# EAGLE design headstage-with-omnetics (EAGLE 6.5.0)
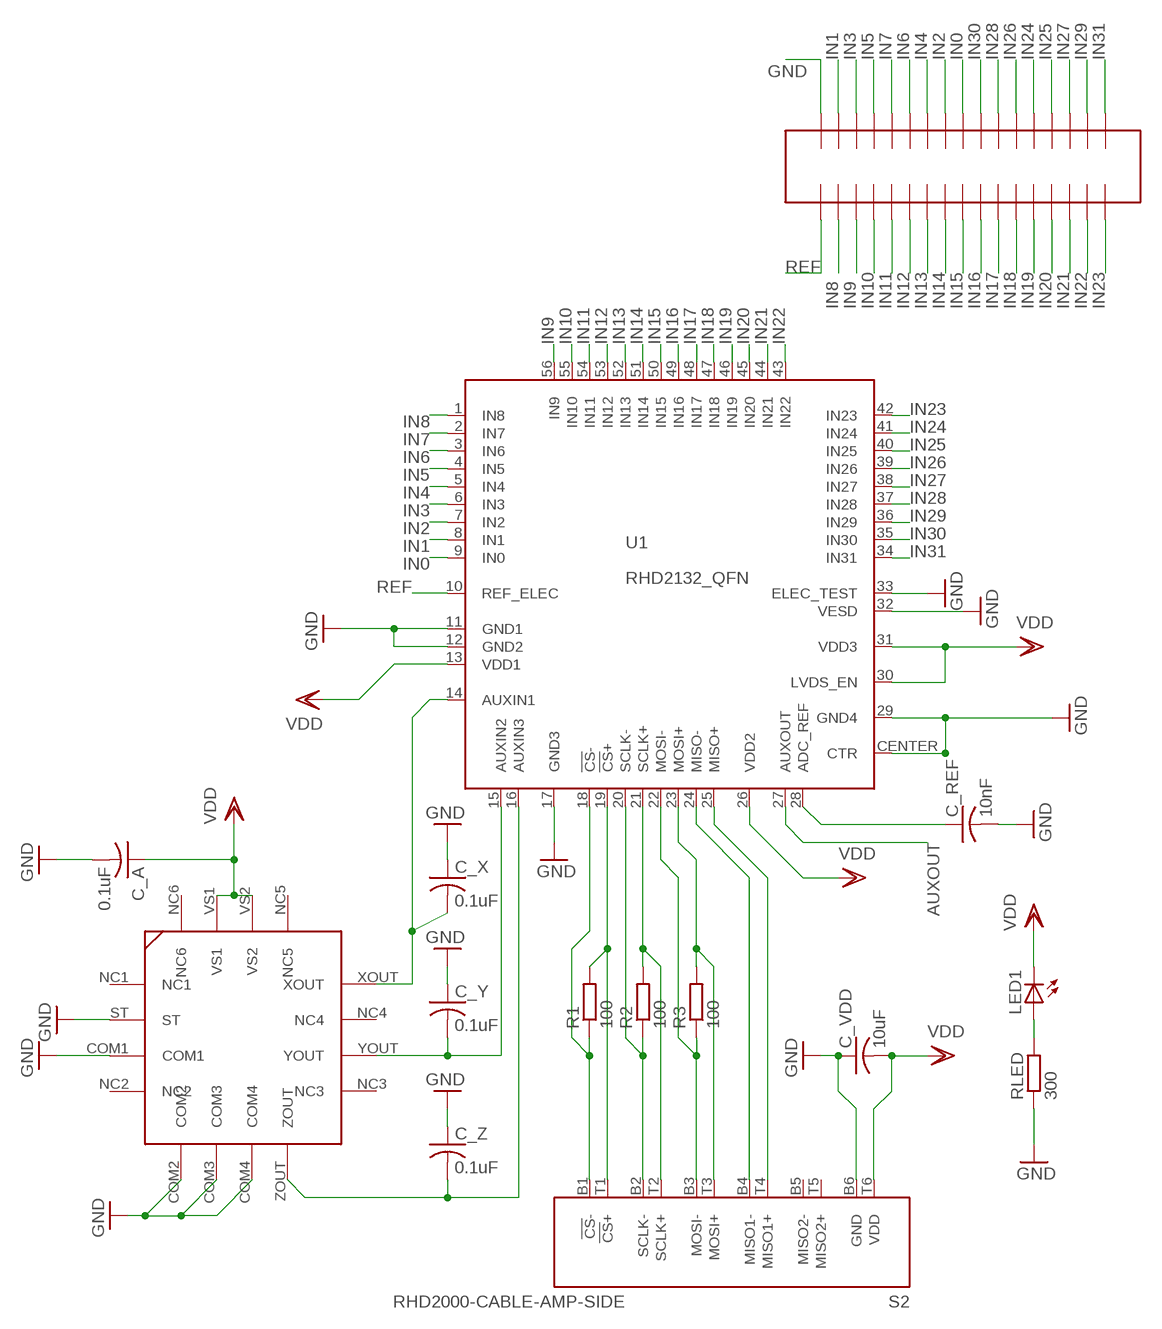
[diagram p0: schematic, sheet 1]

## Parts
C_A  0.1uF  C-USC0402K  [C0402K]
C_REF  10nF  C-USC0402K  [C0402K]
C_VDD  10uF  C-USC0805  [C0805]
C_X  0.1uF  C-USC0402K  [C0402K]
C_Y  0.1uF  C-USC0402K  [C0402K]
C_Z  0.1uF  C-USC0402K  [C0402K]
LED1  LEDCHIPLED_0805  [CHIPLED_0805]
R1  100  R-EU_R0402  [R0402]
R2  100  R-EU_R0402  [R0402]
R3  100  R-EU_R0402  [R0402]
RLED  300  R-EU_R0402  [R0402]
S2  RHD2000-CABLE-AMP-SIDE  [OMNETICS_PZN-12-AA]
U1  RHD2132_QFN  [QFN56_8_X_8_LARGE]
U$1  ADXL335  [ADXL335]
U$2  FTSH-117BOARD-END  [FTSH-117-END]

## Nets
ADC_REF: C_REF.1 U1.28(ADC_REF)
AUXOUT: U1.27(AUXOUT)
CS+: R1.2 S2.T1(!CS!+) U1.19(!CS!+)
CS-: R1.1 S2.B1(!CS!-) U1.18(!CS!-)
GND: C_A.2 C_REF.2 C_VDD.1 C_X.1 C_Y.1 C_Z.1 RLED.1 S2.B6(GND) U1.11(GND1) U1.12(GND2) U1.17(GND3) U1.29(GND4) U1.32(VESD) U1.33(ELEC_TEST) U1.CENTER(CTR) U$1.COM1 U$1.COM2 U$1.COM3 U$1.COM4 U$1.ST U$2.P$34
IN0: U1.9(IN0) U$2.P$26
IN1: U1.8(IN1) U$2.P$33
IN2: U1.7(IN2) U$2.P$27
IN3: U1.6(IN3) U$2.P$32
IN4: U1.5(IN4) U$2.P$28
IN5: U1.4(IN5) U$2.P$31
IN6: U1.3(IN6) U$2.P$29
IN7: U1.2(IN7) U$2.P$30
IN8: U1.1(IN8) U$2.P$2
IN9: U1.56(IN9) U$2.P$3
IN10: U1.55(IN10) U$2.P$4
IN11: U1.54(IN11) U$2.P$5
IN12: U1.53(IN12) U$2.P$6
IN13: U1.52(IN13) U$2.P$7
IN14: U1.51(IN14) U$2.P$8
IN15: U1.50(IN15) U$2.P$9
IN16: U1.49(IN16) U$2.P$10
IN17: U1.48(IN17) U$2.P$11
IN18: U1.47(IN18) U$2.P$12
IN19: U1.46(IN19) U$2.P$13
IN20: U1.45(IN20) U$2.P$14
IN21: U1.44(IN21) U$2.P$15
IN22: U1.43(IN22) U$2.P$16
IN23: U1.42(IN23) U$2.P$17
IN24: U1.41(IN24) U$2.P$22
IN25: U1.40(IN25) U$2.P$21
IN26: U1.39(IN26) U$2.P$23
IN27: U1.38(IN27) U$2.P$20
IN28: U1.37(IN28) U$2.P$24
IN29: U1.36(IN29) U$2.P$19
IN30: U1.35(IN30) U$2.P$25
IN31: U1.34(IN31) U$2.P$18
LEDOUT: LED1.A RLED.2
MISO1+: S2.T4(MISO1+) U1.25(MISO+)
MISO1-: S2.B4(MISO1-) U1.24(MISO-)
MOSI+: R3.2 S2.T3(MOSI+) U1.23(MOSI+)
MOSI-: R3.1 S2.B3(MOSI-) U1.22(MOSI-)
REF: U1.10(REF_ELEC) U$2.P$1
SCLK+: R2.2 S2.T2(SCLK+) U1.21(SCLK+)
SCLK-: R2.1 S2.B2(SCLK-) U1.20(SCLK-)
VDD: C_A.1 C_VDD.2 LED1.C S2.T6(VDD) U1.13(VDD1) U1.26(VDD2) U1.30(LVDS_EN) U1.31(VDD3) U$1.VS1 U$1.VS2
XOUT: C_X.2 U1.14(AUXIN1) U$1.XOUT
YOUT: C_Y.2 U1.15(AUXIN2) U$1.YOUT
ZOUT: C_Z.2 U1.16(AUXIN3) U$1.ZOUT
Unconnected: S2.B5(MISO2-) S2.T5(MISO2+) U$1.NC1 U$1.NC2 U$1.NC3 U$1.NC4 U$1.NC5 U$1.NC6

## Library data of the parts
C_A C_REF C_X C_Y C_Z = resistor:C-US: CAPACITOR, American symbol
C_VDD = rcl:C-US: CAPACITOR, American symbol
LED1 = led:LED: LED OSRAM: - CHIPLED LG R971, LG N971, LY N971, LG Q971, LY Q971, LO R971, LY R971 LH N974, LH R974 LS Q976, LO Q976, LY Q976 LO Q996 - Hyper CHIPLED LW Q18S LB Q993, LB Q99A, LB R99A - SideLED LS A670, LO A670, LY A670, LG A670, LP A670 LB A673, LV A673, LT A673, LW A673 LH A674 LY A675 LS A676, LA A676, LO A676, LY A676, LW A676 LS A679, LY A679, LG A679 - Hyper Micro SIDELED® LS Y876, LA Y876, LO Y876, LY Y876 LT Y87S - SmartLED LW L88C, LW L88S LB L89C, LB L89S, LG L890 LS L89K, LO L89K, LY L89K LS L896, LA L896, LO L896, LY L896 - TOPLED LS T670, LO T670, LY T670, LG T670, LP T670 LSG T670, LSP T670, LSY T670, LOP T670, LYG T670 LG T671, LOG T671, LSG T671 LB T673, LV T673, LT T673, LW T673 LH T674 LS T676, LA T676, LO T676, LY T676, LB T676, LH T676, LSB T676, LW T676 LB T67C, LV T67C, LT T67C, LS T67K, LO T67K, LY T67K, LW E67C LS E67B, LA E67B, LO E67B, LY E67B, LB E67C, LV E67C, LT E67C LW T67C LS T679, LY T679, LG T679 LS T770, LO T770, LY T770, LG T770, LP T770 LB T773, LV T773, LT T773, LW T773 LH T774 LS E675, LA E675, LY E675, LS T675 LS T776, LA T776, LO T776, LY T776, LB T776 LHGB T686 LT T68C, LB T68C - Hyper Mini TOPLED® LB M676 - Mini TOPLED Santana® LG M470 LS M47K, LO M47K, LY M47K Source: http://www.osram.convergy.de LUXEON: - LUMILED® LXK2-PW12-R00, LXK2-PW12-S00, LXK2-PW14-U00, LXK2-PW14-V00 LXK2-PM12-R00, LXK2-PM12-S00, LXK2-PM14-U00 LXK2-PE12-Q00, LXK2-PE12-R00, LXK2-PE12-S00, LXK2-PE14-T00, LXK2-PE14-U00 LXK2-PB12-K00, LXK2-PB12-L00, LXK2-PB12-M00, LXK2-PB14-N00, LXK2-PB14-P00, LXK2-PB14-Q00 LXK2-PR12-L00, LXK2-PR12-M00, LXK2-PR14-Q00, LXK2-PR14-R00 LXK2-PD12-Q00, LXK2-PD12-R00, LXK2-PD12-S00 LXK2-PH12-R00, LXK2-PH12-S00 LXK2-PL12-P00, LXK2-PL12-Q00, LXK2-PL12-R00 Source: www.luxeon.com KINGBRIGHT: KA-3528ASYC Source: www.kingbright.com
R1-R3 RLED = resistor:R-EU_: RESISTOR, European symbol
S2 = RHD2000:RHD2000-CABLE-AMP-SIDE
U1 = RHD2000:RHD2132
U$1 = voigts:ADXL335: The ADXL335 is a small, thin, low power, complete 3-axis accelerometer with signal conditioned voltage outputs. The product measures acceleration with a minimum full-scale range of ±3 g. It can measure the static acceleration of gravity in tilt-sensing applications, as well as dynamic acceleration resulting from motion, shock, or vibration. The user selects the bandwidth of the accelerometer using the CX, CY, and CZ capacitors at the XOUT, YOUT, and ZOUT pins. Bandwidths can be selected to suit the application, with a range of 0.5 Hz to 1600 Hz for the X and Y axes, and a range of 0.5 Hz to 550 Hz for the Z axi
U$2 = Samtec50Mil:FTSH-117: FTSH-117 17x2 Samtec Header 2 row 50 mil spacing

## Board
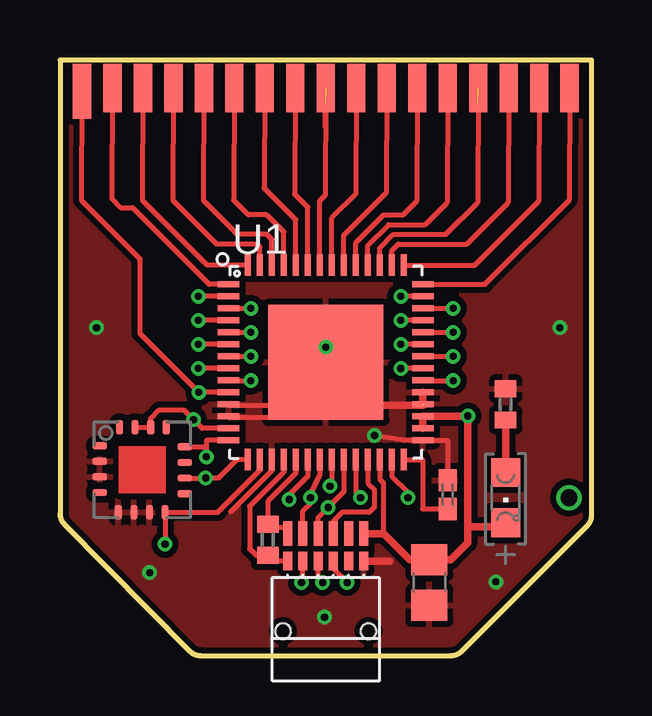
[diagram p1: board, top side]
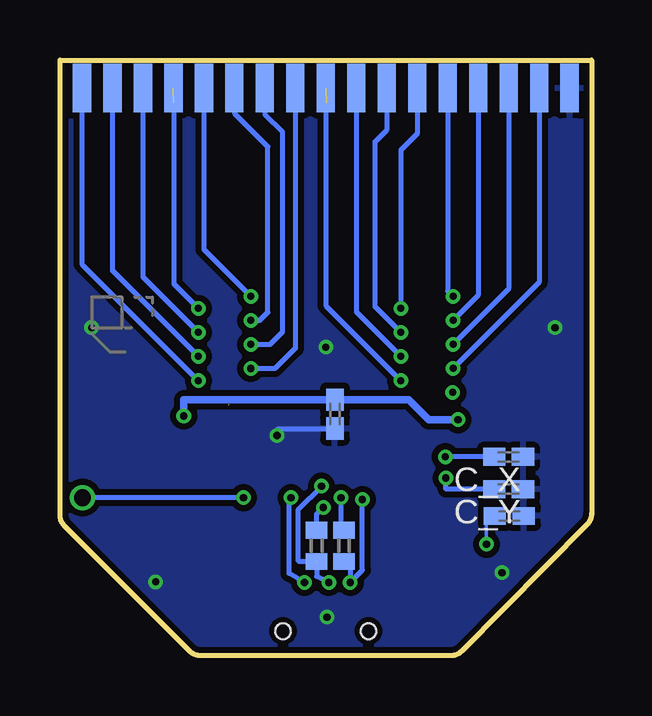
[diagram p2: board, bottom side, seen from below]

Size 22.15 x 24.82 mm. Coordinates in mm from the lower left corner, seen from the top.
Outline: 0,24.82 0,5.91 arc45 0.18,5.46 5.4,0.19 arc45 5.85,0 16.3,0 arc45 16.75,0.19 21.96,5.4 arc45 22.15,5.85 22.15,24.82 0,24.82
Copper layers (1*16): Top 0.035mm / dielectric 1.5mm / Bottom 0.035mm
Design rules "Fusion_eagle_rule_v1.1 *": minimum track width 6mil, minimum drill 0.3mm, track to track 6mil, track to pad 6mil, pad to pad 6mil, via to via 6mil, smd to smd 0mil, copper to edge 10mil, drill to drill 10mil, minimum pad ring 10mil, minimum via ring 6mil, stop-mask expansion 2mil, vias tented up to drill 100mil, thermal gap 10mil
Holes 0.64 mm at 9.3,1.02 12.85,1.02

### Footprints (pad centres in the part's own frame; a part is rotated, then mirrored left to right if it is on the bottom)
C0402K = smd 0.925 x 0.74: 1 -0.6,0; 2 0.6,0
C0805 = smd 1.3 x 1.5: 1 -0.95,0; 2 0.95,0
CHIPLED_0805 = smd 1.2 x 1.2: A 0,-1.05; C 0,1.05
R0402 = smd 0.7 x 0.9: 1 -0.65,0; 2 0.65,0
OMNETICS_PZN-12-AA = smd 0.381 x 0.762: B1 1.587,-1.016; B2 0.953,-1.016; B3 0.318,-1.016; B4 -0.318,-1.016; B5 -0.953,-1.016; B6 -1.587,-1.016 | smd 0.381 x 1.016: T1 1.587,-2.159; T2 0.953,-2.159; T3 0.318,-2.159; T4 -0.318,-2.159; T5 -0.953,-2.159; T6 -1.587,-2.159
QFN56_8_X_8_LARGE = smd 0.9 x 0.25: 1 -4.05,3.25; 2 -4.05,2.75; 3 -4.05,2.25; 4 -4.05,1.75; 5 -4.05,1.25; 6 -4.05,0.75; 7 -4.05,0.25; 8 -4.05,-0.25; 9 -4.05,-0.75; 10 -4.05,-1.25; 11 -4.05,-1.75; 12 -4.05,-2.25; 13 -4.05,-2.75; 14 -4.05,-3.25; 29 4.05,-3.25; 30 4.05,-2.75; 31 4.05,-2.25; 32 4.05,-1.75; 33 4.05,-1.25; 34 4.05,-0.75; 35 4.05,-0.25; 36 4.05,0.25; 37 4.05,0.75; 38 4.05,1.25; 39 4.05,1.75; 40 4.05,2.25; 41 4.05,2.75; 42 4.05,3.25 | smd 0.25 x 0.9: 15 -3.25,-4.05; 16 -2.75,-4.05; 17 -2.25,-4.05; 18 -1.75,-4.05; 19 -1.25,-4.05; 20 -0.75,-4.05; 21 -0.25,-4.05; 22 0.25,-4.05; 23 0.75,-4.05; 24 1.25,-4.05; 25 1.75,-4.05; 26 2.25,-4.05; 27 2.75,-4.05; 28 3.25,-4.05; 43 3.25,4.05; 44 2.75,4.05; 45 2.25,4.05; 46 1.75,4.05; 47 1.25,4.05; 48 0.75,4.05; 49 0.25,4.05; 50 -0.25,4.05; 51 -0.75,4.05; 52 -1.25,4.05; 53 -1.75,4.05; 54 -2.25,4.05; 55 -2.75,4.05; 56 -3.25,4.05 | smd 4.8 x 4.8: CENTER 0,0
ADXL335 = smd 0.61 x 0.305: COM1 -1.775,-0.3; NC1 -1.775,1; NC2 -1.775,-0.95; NC3 1.775,-1; NC4 1.775,0.3; ST -1.775,0.35; XOUT 1.775,0.95; YOUT 1.775,-0.35 | smd 0.305 x 0.61: COM2 -1,-1.775; COM3 -0.35,-1.775; COM4 0.3,-1.775; NC5 1,1.775; NC6 -0.95,1.775; VS1 0.35,1.775; VS2 -0.3,1.775; ZOUT 0.95,-1.775
FTSH-117-END = smd 0.762 x 2.286: P$1 -10.16,-0.127 | smd 0.762 x 2.032: P$2 -8.89,0; P$3 -7.62,0; P$4 -6.35,0; P$5 -5.08,0; P$6 -3.81,0; P$7 -2.54,0; P$8 -1.27,0; P$9 0,0; P$10 1.27,0; P$11 2.54,0; P$12 3.81,0; P$13 5.08,0; P$14 6.35,0; P$15 7.62,0; P$16 8.89,0; P$17 10.16,0 | smd 0.762 x 2.032 bottom: P$18 10.16,0; P$19 8.89,0; P$20 7.62,0; P$21 6.35,0; P$22 5.08,0; P$23 3.81,0; P$24 2.54,0; P$25 1.27,0; P$26 0,0; P$27 -1.27,0; P$28 -2.54,0; P$29 -3.81,0; P$30 -5.08,0; P$31 -6.35,0; P$32 -7.62,0; P$33 -8.89,0; P$34 -10.16,0

### Placement (x,y rotation side)
C_A  10.69,10.06 270 bottom
C_REF  16.15,6.71 90 top
C_VDD  15.39,3.05 90 top
C_X  3.45,8.28 180 bottom
C_Y  3.45,6.93 180 bottom
C_Z  3.43,5.82 180 bottom
LED1  18.57,6.58 180 top
R1  8.66,4.83 90 top
R2  10.31,4.57 90 bottom
R3  11.46,4.57 90 bottom
RLED  18.57,10.46 270 top
S2  11.07,2.92 180 top
U1  11.07,12.22 0 top
U$1  3.43,7.75 0 top
U$2  11.07,23.65 0 top

### Tracks (layer width: path | path; a pad name or v marks a point on that pad's centre or on a via)
ADC_REF
  Top 0.203: U1.28 15.11,8.17 15.11,6.11 C_REF.1
AUXOUT  (via drill 0.3, 0.7)
  Top 0.203: U1.27 13.82,7.46 14.5,6.78 v14.5,6.58
  Bottom 0.203: v14.5,6.58 v21.21,6.58
CS+
  Top 0.203: U1.19 9.82,7.59 8.66,6.43 R1.2 8.66,5.33 9.42,5.33 9.49,5.27 S2.T1
CS-
  Top 0.203: U1.18 9.32,7.65 7.9,6.22 7.9,4.45 8.17,4.18 R1.1 8.9,3.94 S2.B1
GND  (via drill 0.3)  (1 unrouted)
  Top 0.203: 7.01,10.44 9.3,10.44 | 7.01,9.93 9.04,9.93 9.55,10.44 9.3,10.44 | 9.3,10.44 11.07,11.71 | 13.11,10.44 12.98,10.31 | U1.17 8.82,7.71 7.11,5.99 | C_REF.2 16.15,8.97 U1.29 14.32,8.97 v13.11,9.17
  Top 0.305: 12.73,3.94 13.74,3.94 | 15.14,10.44 13.11,10.44 | U1.32 U1.33
  Bottom 0.203: v13.11,9.17 13.11,9.42 10.69,9.42 10.69,9.55
  other vias: 11.02,1.6 18.16,3.07 11.07,12.85 3.73,3.45 1.52,13.67 20.83,13.67
  pour Top (isolate 0.254): 0.13,5.78 5.71,-0.15 16.33,-0.2 22.02,5.71 22.02,24.87 0.13,24.87
  pour Bottom (isolate 0.254): 0.2,24.75 0.08,9.22 0.08,5.61 5.82,-0.13 16.38,-0.13 22.02,5.51 22.02,10.85 21.92,24.77
IN0  (via drill 0.3)  (1 unrouted)
  Top 0.203: v7.95,11.46 6.88,11.46 6.9,11.47 U1.9 | 11.05,22.05 11.05,23.04
  Bottom 0.203: U$2.P$26 11.07,14.58 v7.95,11.46
IN1  (via drill 0.3)
  Top 0.203: U1.8 v5.77,11.97
  Bottom 0.203: U$2.P$33 2.18,15.55 v5.77,11.97
IN2  (via drill 0.3)
  Top 0.203: 6.76,12.47 U1.7 | U1.7 v7.95,12.47 | U1.7
  Bottom 0.203: U$2.P$27 9.8,14.33 v7.95,12.47
IN3  (via drill 0.3)
  Top 0.203: U1.6 v5.77,12.97
  Bottom 0.203: U$2.P$32 3.45,15.28 v5.77,12.97
IN4  (via drill 0.3)
  Top 0.203: U1.5 v7.95,13.47
  Bottom 0.203: v7.95,13.47 9.02,14.53 9.02,21.41 8.53,21.89 U$2.P$28
IN5  (via drill 0.3)
  Top 0.203: U1.4 v5.77,13.97
  Bottom 0.203: U$2.P$31 4.72,15.01 v5.77,13.97
IN6  (via drill 0.3)
  Top 0.203: U1.3 v7.95,14.47
  Bottom 0.203: v7.95,14.47 7.95,21.06 7.26,21.74 U$2.P$29
IN7  (via drill 0.3)
  Top 0.203: U1.2 v5.77,14.97
  Bottom 0.203: U$2.P$30 5.99,15.2 v5.77,14.97
IN8
  Top 0.203: U1.1 6.22,15.47 3.02,18.67 2.51,18.67 2.16,19.02 U$2.P$2
IN9
  Top 0.203: U$2.P$3 3.43,18.97 6.14,16.27 U1.56
IN10
  Top 0.203: U1.55 8.32,17.02 8.2,17.15 6.53,17.15 4.7,18.97 U$2.P$4
IN11
  Top 0.203: U$2.P$5 5.97,18.97 7.39,17.55 8.61,17.55 8.82,17.34 U1.54
IN12
  Top 0.203: U1.53 9.32,17.65 8.61,18.36 7.85,18.36 7.24,18.97 U$2.P$6
IN13
  Top 0.203: U1.52 9.82,18.17 8.51,19.48 U$2.P$7
IN14
  Top 0.203: U1.51 10.32,18.68 9.78,19.23 U$2.P$8
IN15
  Top 0.203: U1.50 10.82,18.95 11.05,19.18 U$2.P$9
IN16
  Top 0.203: U1.49 11.32,18.23 12.32,19.23 U$2.P$10
IN17
  Top 0.203: U1.48 11.82,17.51 13.59,19.28 U$2.P$11
IN18
  Top 0.203: U1.47 12.32,17.2 13.49,18.36 14.3,18.36 14.86,18.92 U$2.P$12
IN19
  Top 0.203: U$2.P$13 16.13,18.87 15.21,17.96 13.69,17.96 12.82,17.09 U1.46
IN20
  Top 0.203: U1.45 13.32,16.98 13.89,17.55 16.08,17.55 17.4,18.87 U$2.P$14
IN21
  Top 0.203: U1.44 13.82,16.87 14.1,17.15 16.94,17.15 18.67,18.87 U$2.P$15
IN22
  Top 0.203: U$2.P$16 19.94,18.92 17.28,16.27 U1.43
IN23
  Top 0.203: U$2.P$17 21.21,18.97 17.7,15.47 U1.42
IN24  (via drill 0.3)
  Top 0.203: U1.41 v14.2,14.97
  Bottom 0.203: U$2.P$22 16.15,16.92 v14.2,14.97
IN25  (via drill 0.3)  (1 unrouted)
  Top 0.203: U1.40 v16.38,14.47
  Bottom 0.203: 17.4,23.04 17.4,15.48 v16.38,14.47
IN26  (via drill 0.3)
  Top 0.203: U1.39 v14.2,13.97
  Bottom 0.203: v14.2,13.97 13.82,13.97 13.49,14.3 13.49,21.21 14.88,22.61 U$2.P$23
IN27  (via drill 0.3)
  Top 0.203: U1.38 v16.38,13.47
  Bottom 0.203: U$2.P$20 18.69,15.78 v16.38,13.47
IN28  (via drill 0.3)
  Top 0.203: U1.37 v14.2,12.97
  Bottom 0.203: v14.2,12.97 13.4,12.97 12.88,13.49 12.88,21.82 13.61,22.56 U$2.P$24
IN29  (via drill 0.3)
  Top 0.203: v16.38,12.47 U1.36
  Bottom 0.203: U$2.P$19 19.96,16.05 v16.38,12.47
IN30  (via drill 0.3)
  Top 0.203: 15.39,11.96 U1.35 | U1.35 v14.2,11.96 | U1.35
  Bottom 0.203: v14.2,11.96 13.18,11.96 12.34,12.8 U$2.P$25
IN31  (via drill 0.3)
  Top 0.203: v16.38,11.46 15.14,11.46 U1.34
  Bottom 0.203: U$2.P$18 21.23,16.31 v16.38,11.46
LEDOUT
  Top 0.305: LED1.A RLED.2
MISO1+
  Top 0.203: S2.T4 11.39,5.6 11.76,5.97 12.88,5.97 13.11,6.2 13.11,6.91 12.82,7.19 U1.25
MISO1-  (via drill 0.3)
  Top 0.203: U1.24 12.32,6.78 v12.52,6.58 | v11.96,3.05 11.39,3.62 S2.B4
  Bottom 0.203: v11.96,3.05 12.6,3.43 12.6,6.5 v12.52,6.58
MOSI+  (via drill 0.3)
  Top 0.203: S2.T3 10.76,5.75 v11.18,6.17 11.82,6.82 U1.23
  Bottom 0.203: R3.2 11.46,5.89 v11.18,6.17
MOSI-  (via drill 0.3)  (1 unrouted)
  Top 0.203: U1.22 11.32,7.13 v11.25,7.06 | v10.95,3.05 10.76,3.24 S2.B3
  Bottom 0.203: v10.95,3.05 11.46,3.3 11.46,3.94 12.22,3.94 12.22,6.1 v11.25,7.06
REF  (via drill 0.3)
  Top 0.203: U$2.P$1 0.89,18.97 3.33,16.54 3.33,13.43 v5.79,10.97 U1.10
SCLK+  (via drill 0.3)
  Top 0.203: U1.21 10.82,7.52 10.44,6.73 v10.44,6.58 10.44,6.35 10.12,6.03 S2.T2
  Bottom 0.203: v10.44,6.58 10.44,5.35 R2.2
SCLK-  (via drill 0.3)
  Top 0.203: U1.20 10.32,7.48 9.55,6.71 v9.55,6.5 | v10.06,3.05 10.12,3.11 S2.B2
  Bottom 0.203: v9.55,6.5 9.55,3.56 v10.06,3.05 10.06,3.67 R2.1
VDD  (via drill 0.3)
  Top 0.203: U1.13 5.93,9.47 v5.56,9.83 5.16,10.24 4.14,10.24 3.78,9.88 U$1.VS1 U$1.VS2 | U1.26 13.32,7.35 13.49,7.19 13.49,5.08 | 16.99,9.97 v16.99,9.98
  Top 0.305: S2.T6 13.49,5.08 14.57,4 C_VDD.2 16.29,4 16.99,4.7 16.99,5.36 | 16.99,5.36 v16.99,9.98 | U1.30 U1.31 16.99,9.97 | LED1.C 18.4,5.36 16.99,5.36
  Bottom 0.305: v5.56,9.83 6.78,9.83 7.61,10.66 C_A.1 16.99,10.66 v16.99,9.98
XOUT  (via drill 0.3)
  Top 0.203: U$1.XOUT 6.1,8.7 v6.1,8.28 6.1,8.97 U1.14
  Bottom 0.203: C_X.2 v6.1,8.28
YOUT  (via drill 0.3)
  Top 0.203: U1.15 7.35,8.17 6.58,7.4 v6.07,7.4 U$1.YOUT
  Bottom 0.203: C_Y.2 6.07,6.93 v6.07,7.4
ZOUT  (via drill 0.3)
  Top 0.203: U1.16 8.32,7.71 6.58,5.97 U$1.ZOUT v4.38,4.64
  Bottom 0.152: C_Z.2 4.38,5.82 v4.38,4.64

### Text on the board
tDocu: ref | aux in | led
bDocu: may 2013 | rev 2.0 samtec | 32ch headstage | open-ephys.org | powered by | oe | intan | C_z,y,x | r100